# Altium project Starboard Deployable 2U.PrjPcb
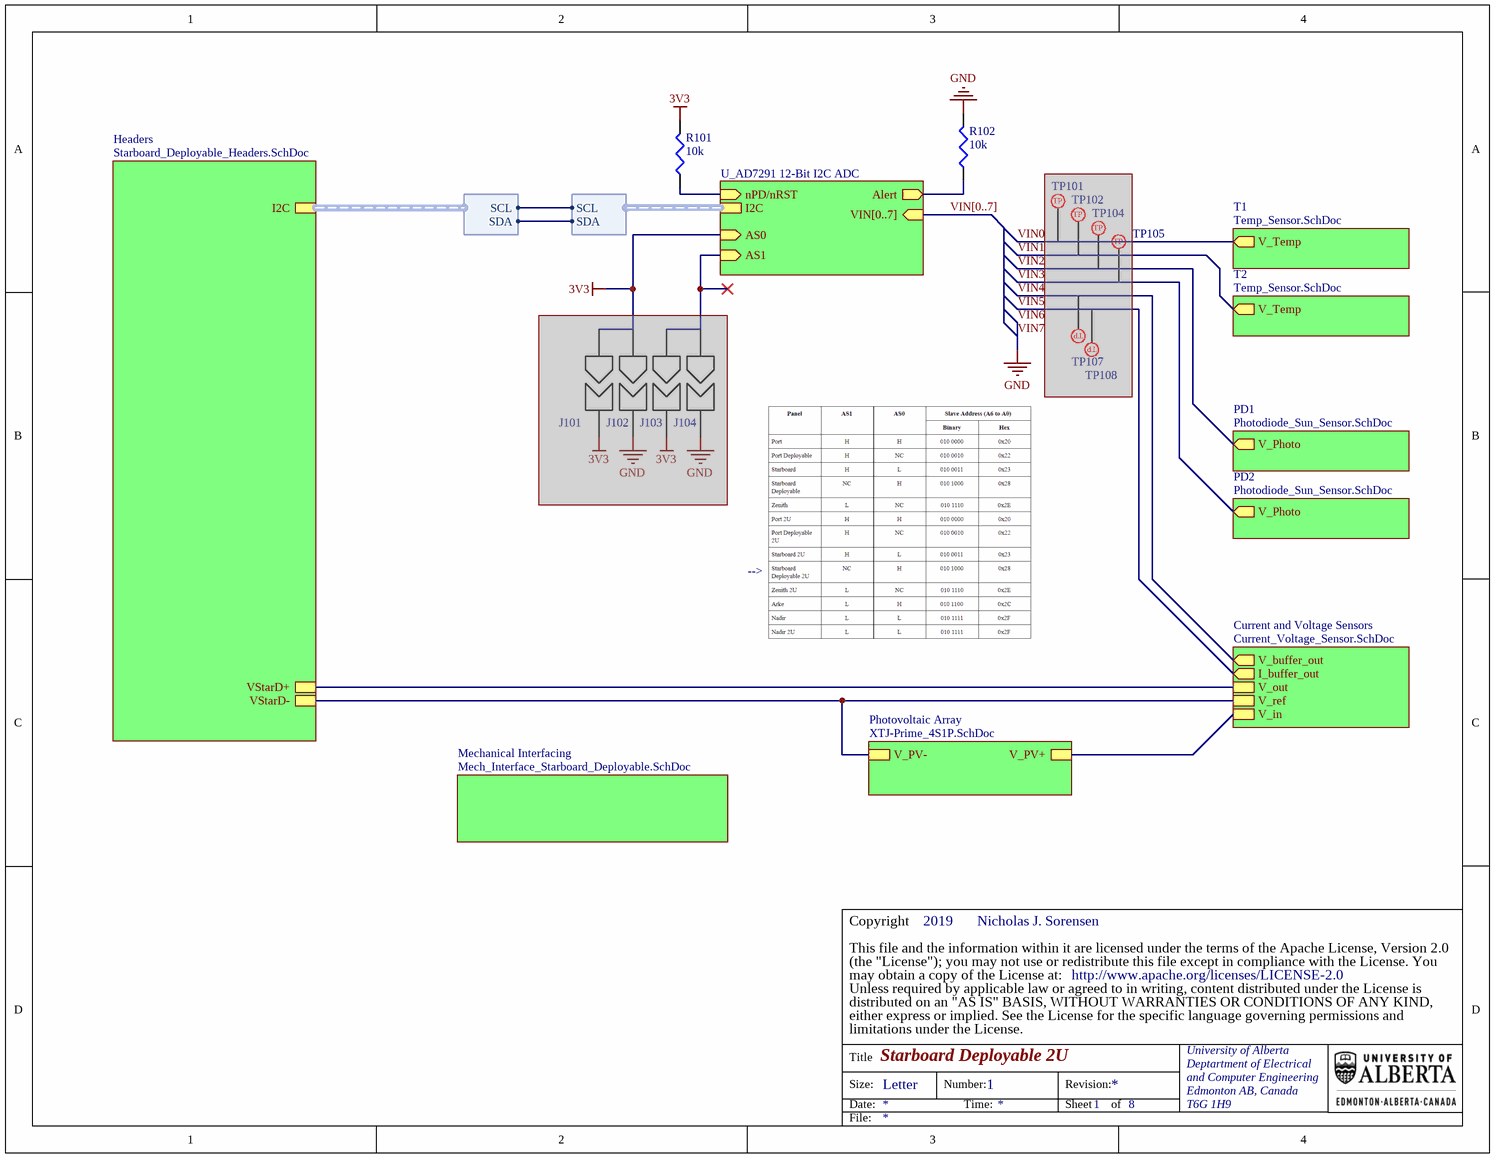
[diagram p0: Starboard Depoyable 2U.SchDoc]
ProjectVersion: 4.02; SVNVersion: 3197
3 sheets, 19 parts. Net scope: hierarchical (ports join the sheet entries above them; power ports are global).
Board file: Starboard Deployable Solar Panel 2U.PcbDoc
Sheets:
  Starboard Depoyable 2U.SchDoc
    Mechanical Interfacing = Mech_Interface_Starboard_Deployable.SchDoc
    Headers = Starboard_Deployable_Headers.SchDoc

## Sheet Starboard Depoyable 2U.SchDoc: Starboard Deployable 2U
size Letter; Author: Nicholas J. Sorensen; DocumentNumber: 1; SheetNumber: 1; SheetTotal: 8; CopyrightYear: 2019

### Parts
J101  Jumping Pad  [Jumping Pad]  (value not drawn)  (masked out: inside a compile mask, not in the netlist)
J102  Jumping Pad  [Jumping Pad]  (value not drawn)  (masked out: inside a compile mask, not in the netlist)
J103  Jumping Pad  [Jumping Pad]  (value not drawn)  (masked out: inside a compile mask, not in the netlist)
J104  Jumping Pad  [Jumping Pad]  (value not drawn)  (masked out: inside a compile mask, not in the netlist)
R101  value 10k  [VSH-0603MCT]  (hidden comment: Res3)
R102  value 10k  [VSH-0603MCT]  (hidden comment: Res3)
TP101  5017  [KS-5017]  (value not drawn)  (masked out: inside a compile mask, not in the netlist)
TP102  5017  [KS-5017]  (value not drawn)  (masked out: inside a compile mask, not in the netlist)
TP104  5017  [KS-5017]  (value not drawn)  (masked out: inside a compile mask, not in the netlist)
TP105  5017  [KS-5017]  (value not drawn)  (masked out: inside a compile mask, not in the netlist)
TP107  5017  [KS-5017]  (value not drawn)  (masked out: inside a compile mask, not in the netlist)
TP108  5017  [KS-5017]  (value not drawn)  (masked out: inside a compile mask, not in the netlist)

### Sub-sheets
Current and Voltage Sensors = Current_Voltage_Sensor.SchDoc (file not in this document): V_out, V_ref, V_in, I_buffer_out (out), V_buffer_out (out)
Headers = Starboard_Deployable_Headers.SchDoc: I2C (harness I2C), VStarD+, VStarD-
Mechanical Interfacing = Mech_Interface_Starboard_Deployable.SchDoc: no entries
PD1 = Photodiode_Sun_Sensor.SchDoc (file not in this document): V_Photo (out)
PD2 = Photodiode_Sun_Sensor.SchDoc (file not in this document): V_Photo (out)
Photovoltaic Array = XTJ-Prime_4S1P.SchDoc (file not in this document): V_PV+, V_PV-
T1 = Temp_Sensor.SchDoc (file not in this document): V_Temp (out)
T2 = Temp_Sensor.SchDoc (file not in this document): V_Temp (out)
U_AD7291 12-Bit I2C ADC = AD7291 12-Bit I2C ADC.SchDoc (file not in this document): nPD/nRST (in), Alert (out), VIN[0..7] (in), AS0 (in), AS1 (in), I2C (harness I2C)

### Harnesses
I2C: SCL, SDA

### Nets
3V3: R101.2 ; sheet U_AD7291 12-Bit I2C ADC/AS0
VIN6: R102.2  [also labelled GND, VIN7]
SCL: sheet U_AD7291 12-Bit I2C ADC/I2C.SCL, sheet Headers/I2C.SCL
SDA: sheet U_AD7291 12-Bit I2C ADC/I2C.SDA, sheet Headers/I2C.SDA
VIN0: sheet T1/V_Temp
VIN1: sheet T2/V_Temp
VIN2: sheet PD1/V_Photo
VIN3: sheet PD2/V_Photo
VIN4: sheet Current and Voltage Sensors/V_buffer_out
VIN5: sheet Current and Voltage Sensors/I_buffer_out
NetP801_5: sheet Photovoltaic Array/V_PV-, sheet Current and Voltage Sensors/V_ref, sheet Headers/VStarD-
NetP801_7: sheet Current and Voltage Sensors/V_out, sheet Headers/VStarD+
NetR101_1: R101.1 ; sheet U_AD7291 12-Bit I2C ADC/nPD/nRST
NetR102_1: R102.1 ; sheet U_AD7291 12-Bit I2C ADC/Alert
(unnamed): sheet Photovoltaic Array/V_PV+, sheet Current and Voltage Sensors/V_in

### Buses and harness runs
bus VIN[0..7] = sheet U_AD7291 12-Bit I2C ADC/VIN[0..7]

### Notes on the sheet
- -->
- (the "License"); you may not use or redistribute this file except in compliance with the License. You
- This file and the information within it are licensed under the terms of the Apache License, Version 2.0
- Copyright
- Unless required by applicable law or agreed to in writing, content distributed under the License is
- distributed on an "AS IS" BASIS, WITHOUT WARRANTIES OR CONDITIONS OF ANY KIND,
- either express or implied. See the License for the specific language governing permissions and
- limitations under the License.
- may obtain a copy of the License at:
- http://www.apache.org/licenses/LICENSE-2.0
- Title
- Size:
- Date:
- Letter
- Number:
- Time:
- Revision:
- Sheet
- of
- University of Alberta
- Deptartment of Electrical
- and Computer Engineering
- Edmonton AB, Canada
- T6G 1H9
- File:
- (in symbol PTP-KS-00001) TP

### Library data of the parts
J101-J104 = PXX-ABS-00011: Manufacturer Part Number: Custom; Index: 11; Designator: J?; Part Number: PXX-ABS-00011; Supplier 1: Digi-key; Publisher: AlbertaSat; LatestRevisionNote: ...
R101 R102 = PR-VSH-00143: RES SMD 10K OHM 1% 1/8W 0603; Manufacturer Part Number: MCT06030C1002FP500; Index: 143; Designator: R?; Temperature Coefficient: ±50ppm/°C; Published: 3/14/2016; LatestRevisionDate: 3/14/2016; LatestRevisionNote: ...; PackageReference: 0603 (1608 Metric); Publisher: AlbertaSat; PackageDescription: Chip Resistor, 2-Leads, Body 1.55x0.85mm, IPC Low Density; Part Number: PR-VSH-00143; Supplier Part Number 1: MCT0603-10.0K-CFCT-ND; Supplier 1: Digi-key; Supplier Link: http://www.digikey.ca/product-search/en?keywords=MCT0603-10.0K-CFCT-ND; Tolerance: ±1%; Power - Rated: 1/8W; Applications: General Purpose
TP101 TP102 TP104 TP105 TP107 TP108 = PTP-KS-00001: PC TEST POINT MINI SMD; Index: 1; Supplier 1: Digi-key; Supplier 2: Newark; Supplier 3: Mouser; Part Number: PTP-KS-00001; Manufacturer Part Number: 5017; Supplier Part Number 1: 36-5017CT-ND; Publisher: AlbertaSat; Published: 3/15/2016; LatestRevisionDate: 3/15/2016; LatestRevisionNote: ...; PackageReference: KS-5017; PackageDescription: Testpoint Lug Mini SMD 27X10X152; Supplier Link: http://www.digikey.ca/product-detail/en/keystone-electronics/5017/36-5017TR-ND/2217304

## Sheet Mech_Interface_Starboard_Deployable.SchDoc: Mech_Interface_Starboard_Deployable
size Letter; Author: Nicholas J. Sorensen, and Erik F. Halliwell; Engineer: Nicholas J. Sorensen, and Erik F. Halliwell; DocumentNumber: 7; SheetNumber: 7; SheetTotal: 8
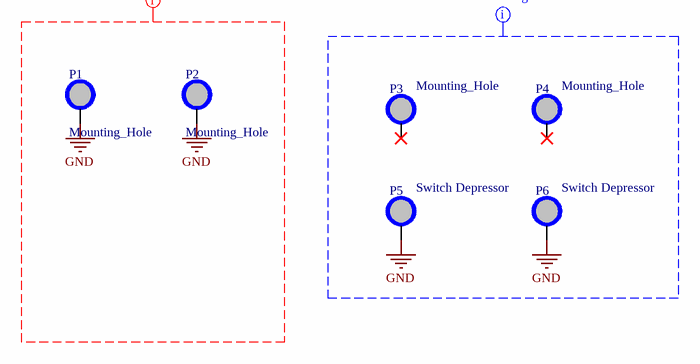
[diagram p1: Mech_Interface_Starboard_Deployable.SchDoc]

### Parts
P1  Mounting_Hole  [Burnwire_Screw_Small_Foot]
P2  Mounting_Hole  [Burnwire_Screw_Small_Foot]
P3  Mounting_Hole  [DepHinge_Mounting_Hole]
P4  Mounting_Hole  [DepHinge_Mounting_Hole]
P5  Switch Depressor  [Switch_Depressor]
P6  Switch Depressor  [Switch_Depressor]

### Nets
GND: P1.1 P2.1 P5.1 P6.1  [project net VIN6]

Not connected (* = marked no-connect by the designer): P3 1(0)*; P4 1(0)*

### Layout directives
mark named Mounting: GND
mark named Burnwire Screws: GND

### Notes on the sheet
- (the "License"); you may not use or redistribute this file except in compliance with the License. You
- This file and the information within it are licensed under the terms of the Apache License, Version 2.0
- Copyright
- Unless required by applicable law or agreed to in writing, content distributed under the License is
- distributed on an "AS IS" BASIS, WITHOUT WARRANTIES OR CONDITIONS OF ANY KIND,
- either express or implied. See the License for the specific language governing permissions and
- limitations under the License.
- may obtain a copy of the License at:
- http://www.apache.org/licenses/LICENSE-2.0
- Title
- Size:
- Date:
- Letter
- Number:
- Time:
- Revision:
- Sheet
- of
- University of Alberta
- Deptartment of Electrical
- and Computer Engineering
- Edmonton AB, Canada
- T6G 1H9
- File:

### Library data of the parts
P1 P2 = PXX-ABS-00016: Manufacturer Part Number: Custom; Index: 16; Designator: M?; Part Number: PXX-ABS-00016; Supplier 1: Digi-key; Publisher: AlbertaSat; LatestRevisionNote: ...
P3 P4 = PXX-ABS-00003: Depolyable Hinge Mounting hole.; Index: 3; Part Number: PXX-ABS-00003; Manufacturer Part Number: N/A; Supplier Part Number 1: N/A; Supplier 1: N/A; Publisher: AlbertaSat; LatestRevisionNote: ...; PackageReference: P?
P5 P6 = PXX-ABS-00005: Hardware for depressing the switch; Manufacturer Part Number: Custom; Index: 5; Designator: P?; Part Number: PXX-ABS-00005; Supplier 1: Digi-key; Publisher: AlbertaSat; LatestRevisionNote: ...

## Sheet Starboard_Deployable_Headers.SchDoc: Starboard_Deployable_Headers
size Letter; Author: Nicholas J. Sorensen, and Erik F. Halliwell; Engineer: Nicholas J. Sorensen, and Erik F. HalliwellNicholas Sorensen, and Erik Halliwell; DocumentNumber: 8; SheetNumber: 8; SheetTotal: 8
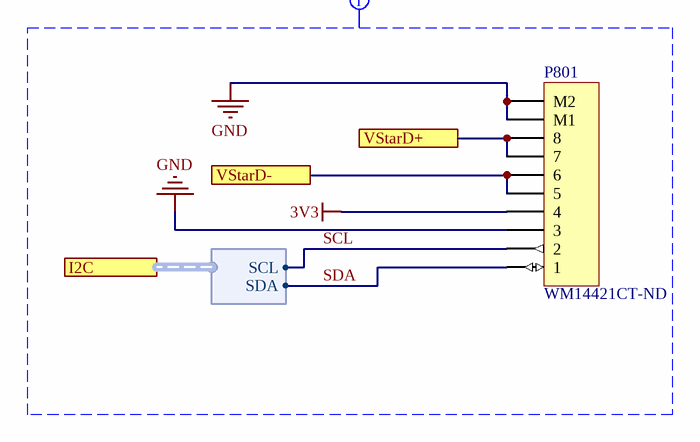
[diagram p2: Starboard_Deployable_Headers.SchDoc]

### Parts
P801  WM14421CT-ND  [MOLX-5040500891]

### Ports
I2C (harness I2C), VStarD+, VStarD-

### Harnesses
I2C: SCL, SDA

### Nets
3V3: P801.4
GND: P801.3 P801.M1 P801.M2  [project net VIN6]
SCL: P801.2 ; port I2C.SCL
SDA: P801.1 ; port I2C.SDA
NetP801_5: P801.5 P801.6 ; port VStarD-
NetP801_7: P801.7 P801.8 ; port VStarD+

### Layout directives
mark named Starboard Deployable to Starboard: 3V3, GND, SCL, SDA

### Notes on the sheet
- (the "License"); you may not use or redistribute this file except in compliance with the License. You
- This file and the information within it are licensed under the terms of the Apache License, Version 2.0
- Copyright
- Unless required by applicable law or agreed to in writing, content distributed under the License is
- distributed on an "AS IS" BASIS, WITHOUT WARRANTIES OR CONDITIONS OF ANY KIND,
- either express or implied. See the License for the specific language governing permissions and
- limitations under the License.
- may obtain a copy of the License at:
- http://www.apache.org/licenses/LICENSE-2.0
- Title
- Size:
- Date:
- Letter
- Number:
- Time:
- Revision:
- Sheet
- of
- University of Alberta
- Deptartment of Electrical
- and Computer Engineering
- Edmonton AB, Canada
- T6G 1H9
- File:

### Library data of the parts
P801 = 67: CONN HEADER SMD R/A 8POS 1.5MM; Part Number: 67; Manufacturer Part Number: 5040500891; Designator: P?; LatestRevisionDate: 17-Jul-2002; LatestRevisionNote: Re-released for DXP Platform.; Publisher: Altium Limited; Supplier Part Number 1: WM14421CT-ND; Supplier 1: Digi-Key; Supplier Link: #https://www.digikey.ca/product-detail/en/molex/5040500891/WM14421CT-ND/6133151#

## Nets that join several sheets
3V3: Starboard Depoyable 2U (R101.2), Starboard_Deployable_Headers (P801.4)
VIN6: Starboard Depoyable 2U (R102.2), Mech_Interface_Starboard_Deployable (P1.1 P2.1 P5.1 P6.1), Starboard_Deployable_Headers (P801.3 P801.M1 P801.M2)